# EAGLE design MAMEInput (EAGLE 5.11)
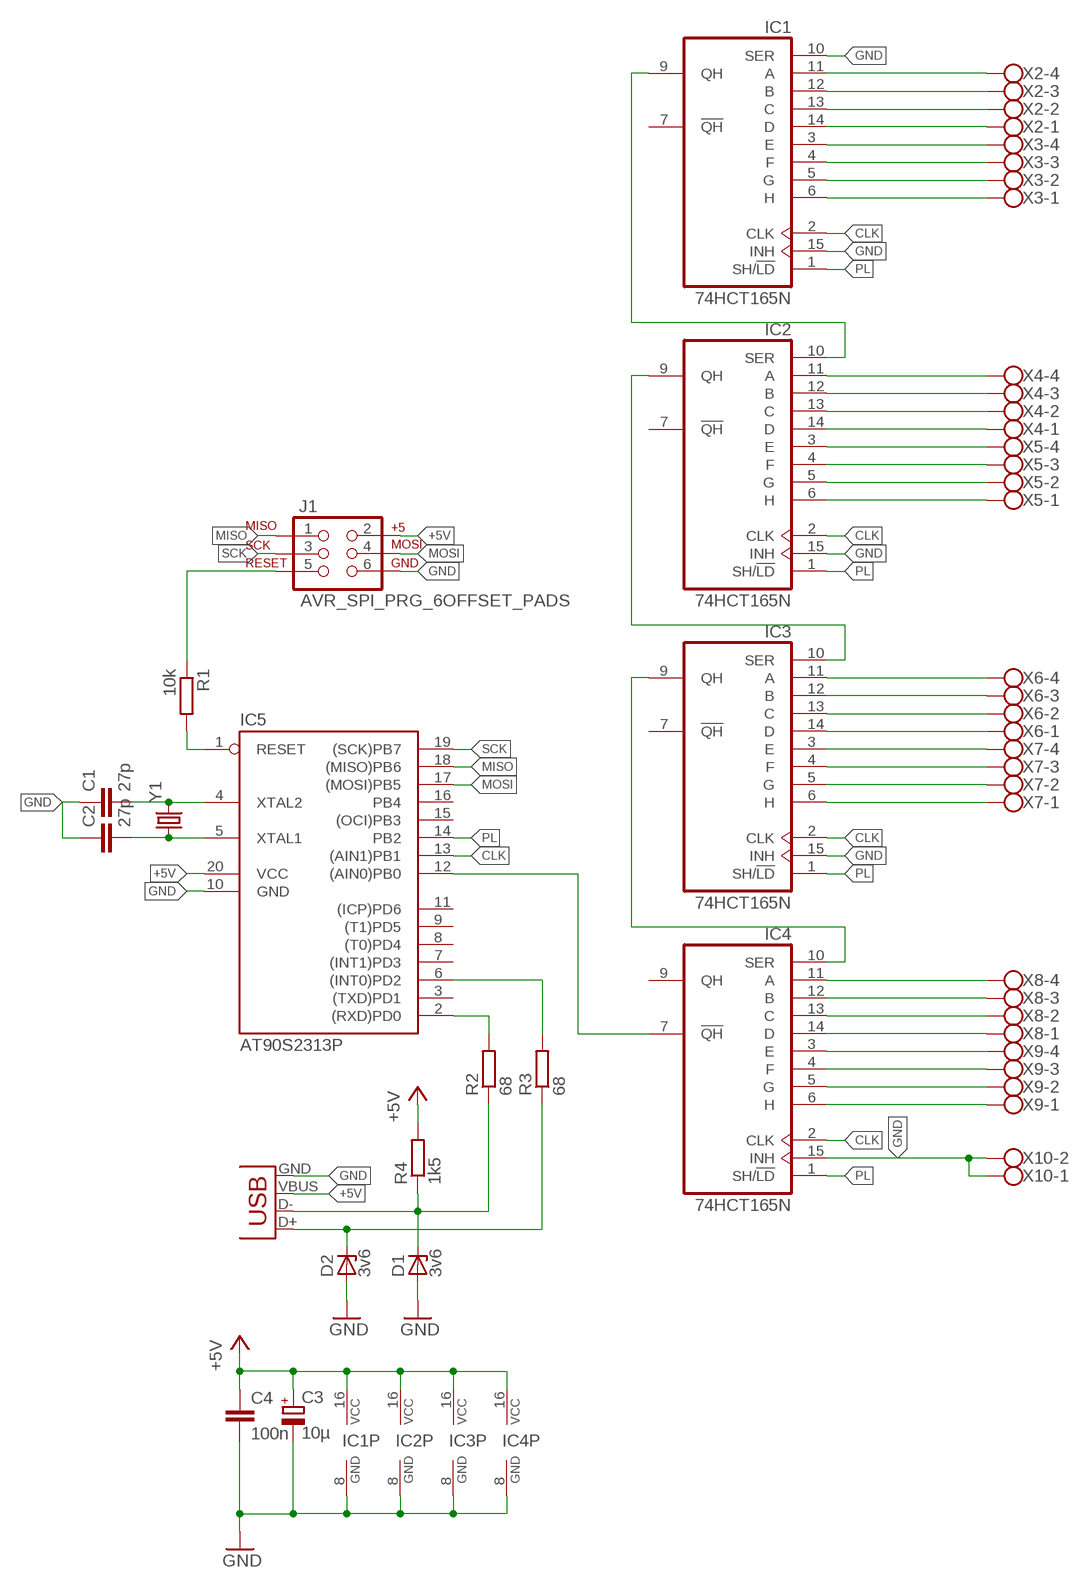
[diagram p0: schematic, sheet 1]

## Parts
C1  27p  C-EU025-025X050  [C025-025X050]
C2  27p  C-EU025-025X050  [C025-025X050]
C3  10µ  CPOL-EUE5-10.5  [E5-10,5]
C4  100n  C-EU050-030X075  [C050-030X075]
D1  3v6  ZENER-DIODEZD-10  [ZDIO-10]
D2  3v6  ZENER-DIODEZD-10  [ZDIO-10]
IC1  74HCT165N  [DIL16]
IC2  74HCT165N  [DIL16]
IC3  74HCT165N  [DIL16]
IC4  74HCT165N  [DIL16]
IC5  AT90S2313P  [DIL20]
J1  AVR_SPI_PRG_6OFFSET_PADS  [2X3_OFFSET]
R1  10k  R-EU_0207/10  [0207/10]
R2  68  R-EU_0207/10  [0207/10]
R3  68  R-EU_0207/10  [0207/10]
R4  1k5  R-EU_0207/10  [0207/10]
X1  USBPTH  [USB-B-PTH]
X2  W237-4  [W237-4]
X3  W237-4  [W237-4]
X4  W237-4  [W237-4]
X5  W237-4  [W237-4]
X6  W237-4  [W237-4]
X7  W237-4  [W237-4]
X8  W237-4  [W237-4]
X9  W237-4  [W237-4]
X10  W237-102  [W237-102]
Y1  CRYSTALHC49US  [HC49US]

## Nets
+5V: C3.+ C4.1 IC1.16(VCC) IC2.16(VCC) IC3.16(VCC) IC4.16(VCC) IC5.20(VCC) J1.2 R4.2 X1.VBUS
CLK: IC1.2(CLK) IC2.2(CLK) IC3.2(CLK) IC4.2(CLK) IC5.13((AIN1)PB1)
GND: C1.1 C2.1 C3.- C4.2 D1.A D2.A IC1.8(GND) IC1.10(SER) IC1.15(INH) IC2.8(GND) IC2.15(INH) IC3.8(GND) IC3.15(INH) IC4.8(GND) IC4.15(INH) IC5.10(GND) J1.6 X1.GND X10.1 X10.2
MISO: IC5.18((MISO)PB6) J1.1
MOSI: IC5.17((MOSI)PB5) J1.4
N$1: C1.2 IC5.4(XTAL2) Y1.2
N$2: C2.2 IC5.5(XTAL1) Y1.1
N$3: IC5.1(RESET) R1.2
N$4: IC5.6((INT0)PD2) R3.2
N$5: IC5.2((RXD)PD0) R2.2
N$6: D1.C R2.1 R4.1 X1.D-
N$7: D2.C R3.1 X1.D+
N$8: IC1.9(QH) IC2.10(SER)
N$9: IC2.9(QH) IC3.10(SER)
N$10: IC3.9(QH) IC4.10(SER)
N$11: J1.5 R1.1
N$12: IC4.7(!QH) IC5.12((AIN0)PB0)
N$13: IC1.11(A) X2.4
N$14: IC1.12(B) X2.3
N$15: IC1.13(C) X2.2
N$16: IC1.14(D) X2.1
N$17: IC1.3(E) X3.4
N$18: IC1.4(F) X3.3
N$19: IC1.5(G) X3.2
N$20: IC1.6(H) X3.1
N$21: IC2.11(A) X4.4
N$22: IC2.12(B) X4.3
N$23: IC2.13(C) X4.2
N$24: IC2.14(D) X4.1
N$25: IC2.3(E) X5.4
N$26: IC2.4(F) X5.3
N$27: IC2.5(G) X5.2
N$28: IC2.6(H) X5.1
N$29: IC3.11(A) X6.4
N$30: IC3.12(B) X6.3
N$31: IC3.13(C) X6.2
N$32: IC4.11(A) X8.4
N$33: IC4.12(B) X8.3
N$34: IC4.13(C) X8.2
N$35: IC4.14(D) X8.1
N$36: IC4.3(E) X9.4
N$37: IC4.4(F) X9.3
N$38: IC4.5(G) X9.2
N$39: IC4.6(H) X9.1
N$41: IC3.14(D) X6.1
N$42: IC3.3(E) X7.4
N$43: IC3.4(F) X7.3
N$44: IC3.5(G) X7.2
N$45: IC3.6(H) X7.1
PL: IC1.1(SH/!LD) IC2.1(SH/!LD) IC3.1(SH/!LD) IC4.1(SH/!LD) IC5.14(PB2)
SCK: IC5.19((SCK)PB7) J1.3
Unconnected: IC1.7(!QH) IC2.7(!QH) IC3.7(!QH) IC4.9(QH) IC5.3((TXD)PD1) IC5.7((INT1)PD3) IC5.8((T0)PD4) IC5.9((T1)PD5) IC5.11((ICP)PD6) IC5.15((OCI)PB3) IC5.16(PB4)

## Library data of the parts
C1 C2 C4 = rcl:C-EU: CAPACITOR, European symbol
C3 = rcl:CPOL-EU: POLARIZED CAPACITOR, European symbol
D1 D2 = diode:ZENER-DIODE: Z-Diode
IC1-IC4 = 74xx-eu:74*165: 8-bit parallel load SHIFT REGISTER
IC5 = atmel:AT90S2313: MICROCONTROLLER 2 Kbytes FLASH 128 bytes SRAM 128 bytes EEPROM UART; OC_FARNELL: unknown; OC_NEWARK: unknown
J1 = SparkFun:AVR_SPI_PRG_6: AVR ISP 6 Pin This is the reduced ISP connector for AVR programming. Common on Arduino. This footprint will take up less PCB space and can be used with a 10-pin to 6-pin adapter such as SKU: BOB-08508
R1-R4 = rcl:R-EU_: RESISTOR, European symbol
X1 = SparkFun:USB: USB Connectors USB-B-PTH is fully proven SKU : PRT-00139 USB-miniB is fully proven SKU : PRT-00587 USB-A-PCB is untested. USB-A-H is throughly reviewed, but untested. Spark Fun Electronics SKU : PRT-00437 USB-B-SMT is throughly reviewed, but untested. Needs silkscreen touching up. USB-A-S has not been used/tested USB-MB-H has not been used/tested
X2-X9 = con-wago-500:W237-4: WAGO SCREW CLAMP; OC_FARNELL: unknown; OC_NEWARK: unknown
X10 = con-wago-500:W237-102: WAGO SCREW CLAMP; MPN: 237-102; OC_FARNELL: unknown; OC_NEWARK: 70K9898
Y1 = SparkFun:CRYSTAL: Crystals Various standard crystals. Proven footprints. Spark Fun Electronics SKU : COM-00534

## Board
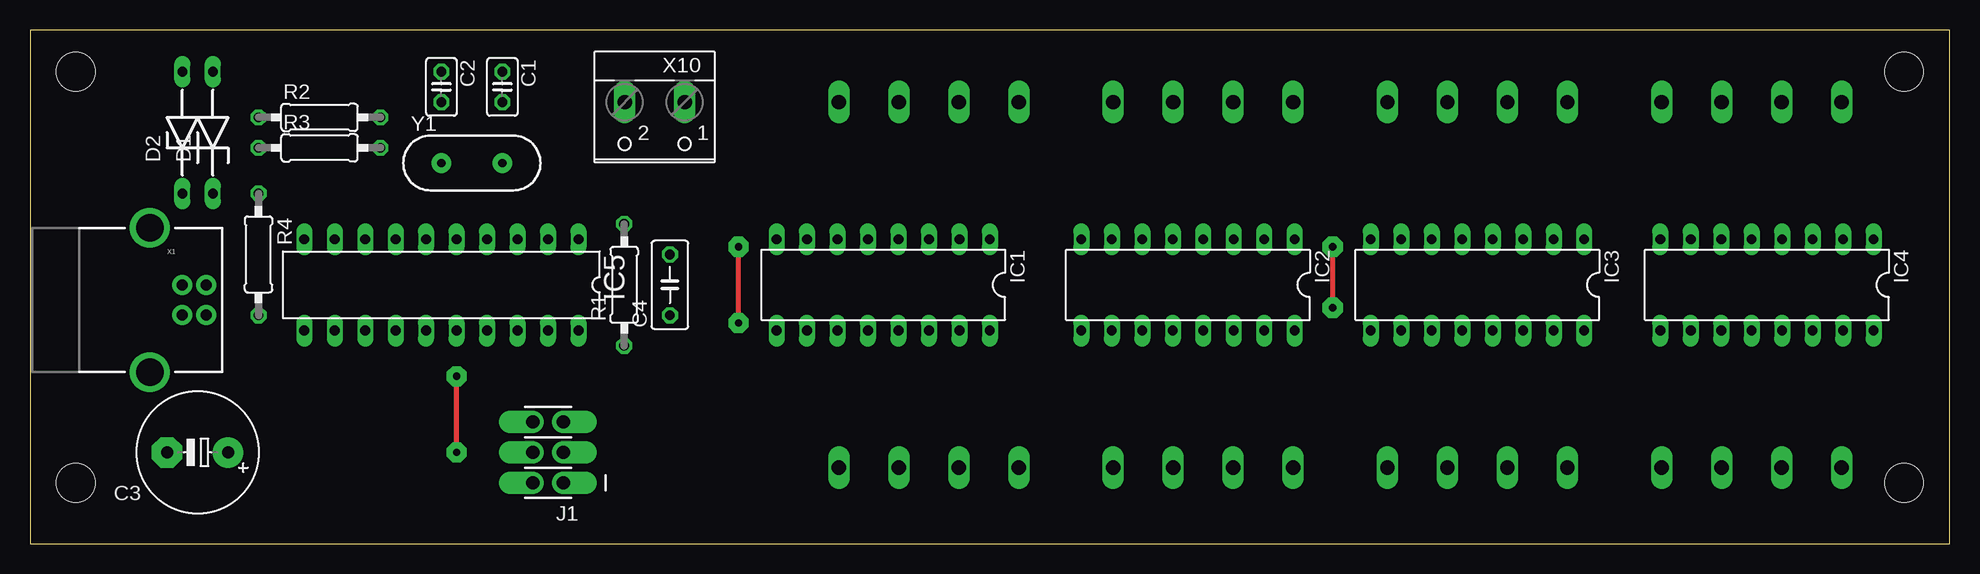
[diagram p1: board, top side]
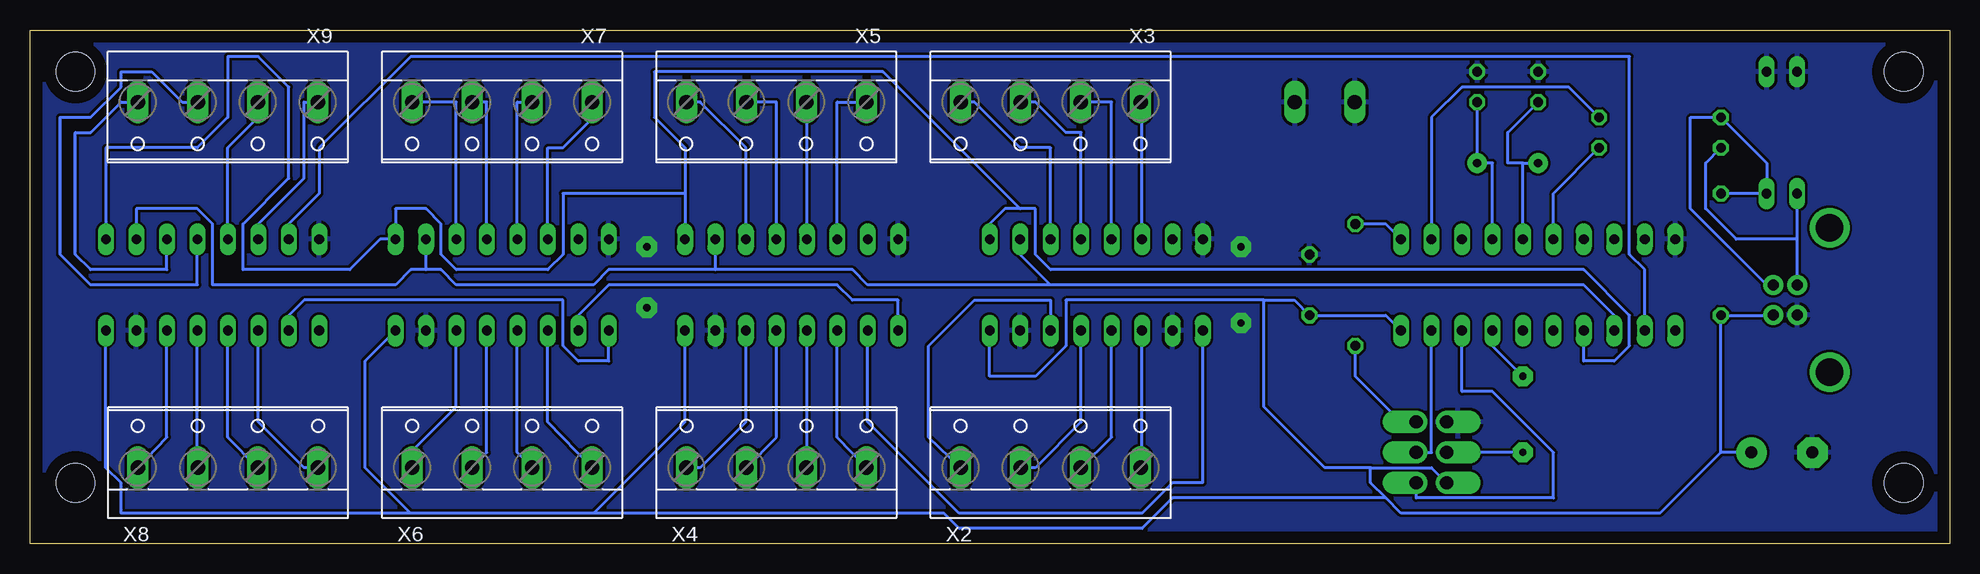
[diagram p2: board, bottom side, seen from below]

Size 160 x 42.85 mm. Coordinates in mm from the lower left corner, seen from the top.
Outline: 0,0 160,0 160,42.85 0,42.85 0,0
Copper layers (1*16): Top 0.035mm / dielectric 1.5mm / Bottom 0.035mm
Design rules "default *": minimum track width 10mil, minimum drill 24mil, track to track 8mil, track to pad 8mil, pad to pad 8mil, via to via 8mil, smd to smd 8mil, copper to edge 40mil, drill to drill 8mil, minimum pad ring 10mil, minimum via ring 8mil, stop-mask expansion 4mil, vias tented up to drill 0mil, thermal gap 10mil
Holes 3.2 mm at 3.81,39.37 3.81,5.08 156.21,39.37 156.21,5.08

### Footprints (pad centres in the part's own frame; a part is rotated, then mirrored left to right if it is on the bottom)
C025-025X050 = drill 0.813 octagon: 1 -1.27,0; 2 1.27,0
E5-10,5 = drill 1.016 pad 2.54 round: + -2.54,0 | drill 1.016 pad 2.54 octagon: - 2.54,0
C050-030X075 = drill 0.813 octagon: 1 -2.54,0; 2 2.54,0
ZDIO-10 = drill 0.813 long: A 5.08,0; C -5.08,0
DIL16 = drill 0.813 long: 1 -8.89,-3.81; 2 -6.35,-3.81; 3 -3.81,-3.81; 4 -1.27,-3.81; 5 1.27,-3.81; 6 3.81,-3.81; 7 6.35,-3.81; 8 8.89,-3.81; 9 8.89,3.81; 10 6.35,3.81; 11 3.81,3.81; 12 1.27,3.81; 13 -1.27,3.81; 14 -3.81,3.81; 15 -6.35,3.81; 16 -8.89,3.81
DIL20 = drill 0.813 long: 1 -11.43,-3.81; 2 -8.89,-3.81; 3 -6.35,-3.81; 4 -3.81,-3.81; 5 -1.27,-3.81; 6 1.27,-3.81; 7 3.81,-3.81; 8 6.35,-3.81; 9 8.89,-3.81; 10 11.43,-3.81; 11 11.43,3.81; 12 8.89,3.81; 13 6.35,3.81; 14 3.81,3.81; 15 1.27,3.81; 16 -1.27,3.81; 17 -3.81,3.81; 18 -6.35,3.81; 19 -8.89,3.81; 20 -11.43,3.81
2X3_OFFSET = drill 1.118 pad 1.88 offset: 1 -2.54,-1.27; 2 -2.54,1.27; 3 0,-1.27; 4 0,1.27; 5 2.54,-1.27; 6 2.54,1.27
0207/10 = drill 0.813 octagon: 1 -5.08,0; 2 5.08,0
USB-B-PTH = drill 0.914 pad 1.676 round: D+ 0,1.25; D- 1.981,1.25; GND 0,-1.25; VBUS 1.981,-1.25 | drill 2.286 round: S1 -2.718,-6.02; S2 -2.718,6.02
W237-4 = drill 1.194 long: 1 -7.5,-1.27; 2 -2.5,-1.27; 3 2.5,-1.27; 4 7.5,-1.27
W237-102 = drill 1.194 long: 1 -2.5,-1.27; 2 2.5,-1.27
HC49US = drill 0.7 pad 1.651 round: 1 -2.54,0; 2 2.54,0

### Placement (x,y rotation side)
C1  39.37,38.1 270 top
C2  34.29,38.1 270 top
C3  13.97,7.62 180 top
C4  53.34,21.59 90 top
D1  15.24,34.29 90 top
D2  12.7,34.29 90 top
IC1  71.12,21.59 180 top
IC2  96.52,21.59 180 top
IC3  120.65,21.59 180 top
IC4  144.78,21.59 180 top
IC5  34.29,21.59 180 top
J1  43.18,7.62 90 top
R1  49.53,21.59 90 top
R2  24.13,35.56 0 top
R3  24.13,33.02 0 top
R4  19.05,24.13 270 top
X1  12.7,20.32 0 top
X2  74.93,7.62 0 bottom
X3  74.93,35.56 180 bottom
X4  97.79,7.62 0 bottom
X5  97.79,35.56 180 bottom
X6  120.65,7.62 0 bottom
X7  120.65,35.56 180 bottom
X8  143.51,7.62 0 bottom
X9  143.51,35.56 180 bottom
X10  52.07,35.56 180 top
Y1  36.83,31.75 0 top

### Tracks (layer width: path | path; a pad name or v marks a point on that pad's centre or on a via)
+5V
  Bottom 0.254: IC2.16 105.41,10.16 113.03,2.54 | 113.03,2.54 128.27,2.54 | 128.27,2.54 132.08,6.35 132.08,15.24 IC3.16 | IC4.16 153.67,6.35 152.4,5.08 152.4,2.54 128.27,2.54 | X1.VBUS 15.24,19.05 R4.2 19.05,7.62 | C3.+ 19.05,7.62 | IC5.20 46.99,19.05 C4.1 54.61,20.32 57.15,20.32 | IC1.16 80.01,13.97 76.2,13.97 73.66,16.51 73.66,20.32 57.15,20.32 | J1.2 43.18,6.35 48.26,6.35 | 48.26,6.35 52.07,6.35 57.15,11.43 57.15,20.32 | 19.05,7.62 24.13,2.54 45.72,2.54 46.99,3.81 | 46.99,3.81 48.26,5.08 48.26,6.35 | 46.99,3.81 64.77,3.81 67.31,1.27 82.55,1.27 83.82,2.54 113.03,2.54
CLK
  Bottom 0.254: IC5.13 27.94,19.05 30.48,21.59 74.93,21.59 | 74.93,21.59 77.47,24.13 IC1.2 | 102.87,22.86 IC2.2 | 102.87,22.86 91.44,22.86 90.17,21.59 74.93,21.59 | 127,22.86 IC3.2 | 127,22.86 125.73,22.86 124.46,21.59 113.03,21.59 111.76,22.86 102.87,22.86 | IC4.2 151.13,27.94 146.05,27.94 144.78,26.67 144.78,21.59 129.54,21.59 128.27,22.86 127,22.86
GND  (via drill 0.6 pad 1.68)
  Top 0.406: v108.58,19.68 v108.58,24.77 | v59.05,18.41 v59.05,24.77
  pour Bottom: 0,43.18 160.02,43.18 160.02,0 0,0
MISO
  Bottom 0.254: IC5.18 40.64,12.7 38.1,12.7 33.02,7.62 33.02,3.81 44.45,3.81 J1.1
MOSI  (via drill 0.6 pad 1.68)
  Top 0.406: v35.56,7.62 v35.56,13.97
  Bottom 0.254: v35.56,13.97 38.1,16.51 IC5.17 | v35.56,7.62 J1.4
N$1
  Bottom 0.254: IC5.4 38.1,31.75 Y1.2 C1.2
N$2
  Bottom 0.254: IC5.5 35.56,31.75 | 35.56,31.75 Y1.1 | C2.2 36.83,34.29 36.83,31.75 35.56,31.75
N$3
  Bottom 0.254: IC5.1 46.99,26.67 R1.2
N$4
  Bottom 0.254: IC5.6 33.02,29.21 R3.2
N$5
  Bottom 0.254: R2.2 31.75,38.1 40.64,38.1 43.18,35.56 IC5.2
N$6
  Bottom 0.254: R4.1 D1.C 15.24,31.75 R2.1 21.59,35.56 21.59,27.94 15.24,21.59 X1.D-
N$7
  Bottom 0.254: 12.7,25.4 D2.C | X1.D+ 12.7,25.4 | R3.1 20.32,31.75 20.32,27.94 17.78,25.4 12.7,25.4
N$8
  Bottom 0.254: IC1.9 62.23,5.08 64.77,5.08 67.31,2.54 82.55,2.54 90.17,10.16 IC2.10
N$9
  Bottom 0.254: IC2.9 87.63,20.32 91.44,20.32 92.71,21.59 111.76,21.59 114.3,19.05 IC3.10
N$10
  Bottom 0.254: IC3.9 111.76,15.24 114.3,15.24 115.57,16.51 115.57,20.32 137.16,20.32 138.43,19.05 IC4.10
N$11
  Bottom 0.254: R1.1 49.53,13.97 45.72,10.16 J1.5
N$12
  Bottom 0.254: IC5.12 25.4,22.86 26.67,24.13 26.67,40.64 128.27,40.64 135.89,33.02 135.89,29.21 138.43,26.67 IC4.7
N$13
  Bottom 0.254: IC1.11 67.31,6.35 X2.4
N$14
  Bottom 0.254: IC1.12 69.85,8.89 X2.3
N$15
  Bottom 0.254: IC1.13 72.39,10.16 76.2,6.35 X2.2 77.47,6.35
N$16
  Bottom 0.254: IC1.14 74.93,20.32 81.28,20.32 85.09,16.51 85.09,8.89 X2.1
N$17
  Bottom 0.254: IC1.3 74.93,33.02 77.47,33.02 81.28,36.83 X3.4 82.55,36.83
N$18
  Bottom 0.254: IC1.4 72.39,34.29 73.66,34.29 76.2,36.83 X3.3 77.47,36.83
N$19
  Bottom 0.254: IC1.5 69.85,36.83 X3.2
N$20
  Bottom 0.254: IC1.6 67.31,36.83 X3.1
N$21
  Bottom 0.254: IC2.11 92.71,8.89 X4.4 90.17,6.35
N$22
  Bottom 0.254: IC2.12 95.25,6.35 X4.3
N$23
  Bottom 0.254: IC2.13 97.79,8.89 X4.2 100.33,6.35
N$24
  Bottom 0.254: IC2.14 100.33,10.16 104.14,6.35 X4.1 105.41,6.35
N$25
  Bottom 0.254: IC2.3 100.33,33.02 104.14,36.83 X5.4 105.41,36.83
N$26
  Bottom 0.254: IC2.4 97.79,36.83 X5.3 100.33,36.83
N$27
  Bottom 0.254: IC2.5 95.25,36.83 X5.2
N$28
  Bottom 0.254: IC2.6 92.71,36.83 X5.1 90.17,36.83
N$29
  Bottom 0.254: IC3.11 116.84,10.16 X6.4 113.03,6.35
N$30
  Bottom 0.254: IC3.12 119.38,7.62 X6.3 118.11,6.35
N$31
  Bottom 0.254: IC3.13 121.92,7.62 X6.2 123.19,6.35
N$32
  Bottom 0.254: IC4.11 140.97,10.16 137.16,6.35 X8.4 135.89,6.35
N$33
  Bottom 0.254: IC4.12 143.51,8.89 X8.3 140.97,6.35
N$34
  Bottom 0.254: IC4.13 146.05,6.35 X8.2
N$35
  Bottom 0.254: IC4.14 148.59,8.89 X8.1 151.13,6.35
N$36
  Bottom 0.254: IC4.3 148.59,22.86 154.94,22.86 156.21,24.13 156.21,34.29 154.94,34.29 152.4,36.83 X9.4
N$37
  Bottom 0.254: IC4.4 146.05,21.59 154.94,21.59 157.48,24.13 157.48,35.56 154.94,35.56 152.4,38.1 152.4,39.37 149.86,39.37 147.32,36.83 X9.3
N$38
  Bottom 0.254: IC4.5 143.51,33.02 140.97,35.56 140.97,36.83 X9.2
N$39
  Bottom 0.254: IC4.6 140.97,26.67 137.16,30.48 137.16,36.83 X9.1 135.89,36.83
N$41
  Bottom 0.254: IC3.14 124.46,11.43 128.27,7.62 128.27,6.35 X6.1
N$42
  Bottom 0.254: IC3.3 124.46,36.83 X7.4 128.27,36.83
N$43
  Bottom 0.254: IC3.4 121.92,36.83 X7.3 123.19,36.83
N$44
  Bottom 0.254: IC3.5 119.38,36.83 X7.2 118.11,36.83
N$45
  Bottom 0.254: IC3.6 116.84,33.02 115.57,33.02 113.03,35.56 113.03,36.83 X7.1
PL
  Bottom 0.254: IC5.14 30.48,15.24 27.94,15.24 26.67,16.51 26.67,19.05 30.48,22.86 74.93,22.86 76.2,24.13 76.2,27.94 77.47,27.94 | 77.47,27.94 78.74,27.94 80.01,26.67 IC1.1 | 105.41,29.21 105.41,33.02 107.95,35.56 107.95,39.37 88.9,39.37 77.47,27.94 | 105.41,29.21 IC2.1 | 105.41,29.21 115.57,29.21 115.57,24.13 116.84,22.86 124.46,22.86 125.73,24.13 125.73,26.67 127,27.94 129.54,27.94 IC3.1 130.81,25.4 133.35,22.86 142.24,22.86 142.24,26.67 138.43,30.48 138.43,38.1 140.97,40.64 143.51,40.64 143.51,35.56 146.05,33.02 153.67,33.02 IC4.1
SCK
  Bottom 0.254: IC5.19 43.18,7.62 J1.3